# EAGLE design Interactive_SparkFun_Badge (EAGLE 6.6.0)
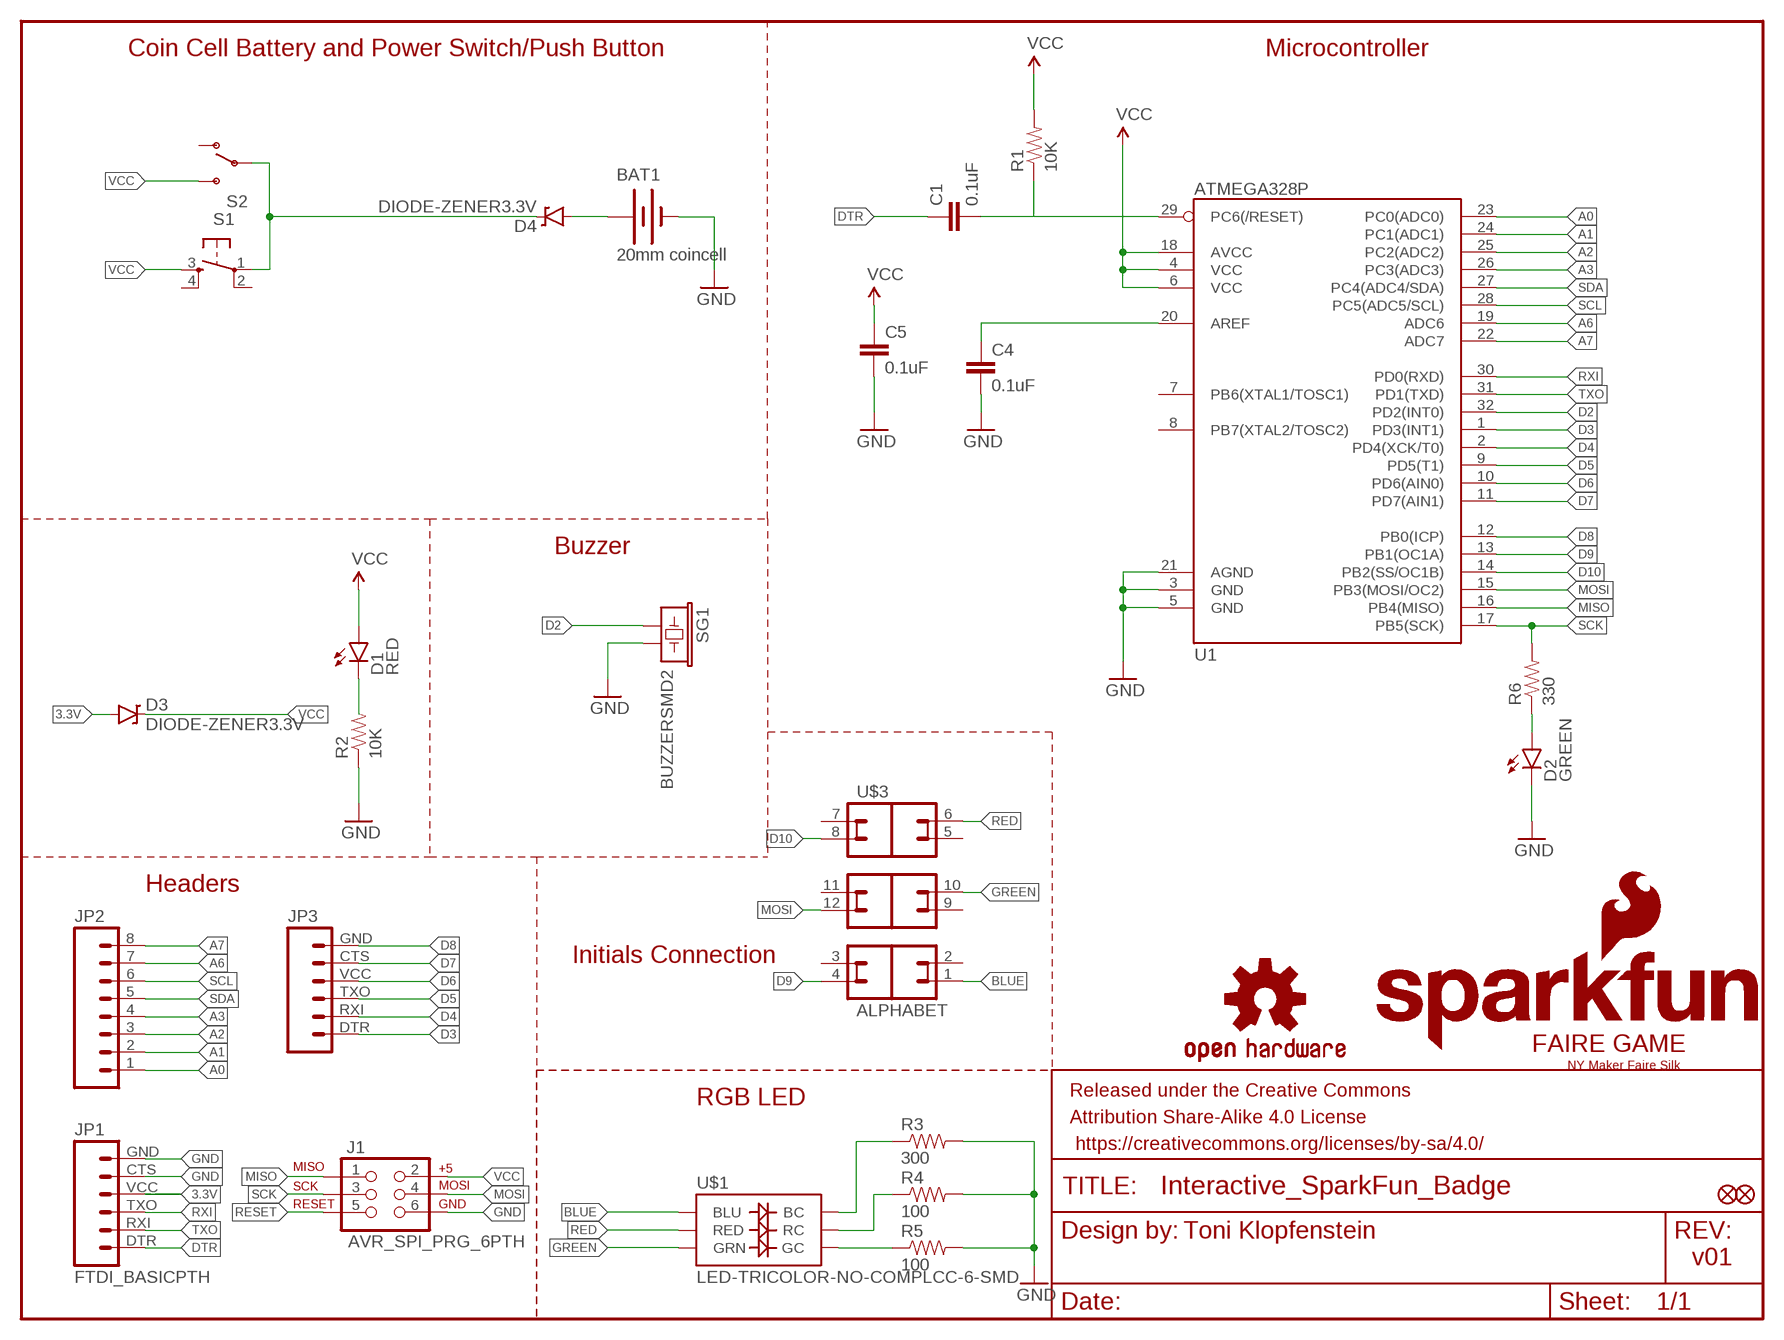
[diagram p0: schematic, sheet 1]

## Parts
BAT1  20mm coincell  BATTERY20MM_4LEGS  [BATTCON_20MM_4LEGS]
C1  0.1uF  0.1UF-25V(+80/-20%)(0603)  [0603-CAP]
C4  0.1uF  0.1UF-25V(+80/-20%)(0603)  [0603-CAP]
C5  0.1uF  0.1UF-25V(+80/-20%)(0603)  [0603-CAP]
D1  RED  LED-RED0603  [LED-0603]
D2  GREEN  LED-GREEN0603  [LED-0603]
D3  DIODE-ZENER3.3V  [SOD-323]
D4  DIODE-ZENER3.3V  [SOD-323]
FID1  FIDUCIAL1X2  [FIDUCIAL-1X2]
FID2  FIDUCIAL1X2  [FIDUCIAL-1X2]
FRAME1  FRAME-LETTER  [CREATIVE_COMMONS]
J1  AVR_SPI_PRG_6PTH  [2X3]
JP1  FTDI_BASICPTH  [FTDI_BASIC]
JP2  M081X08  [1X08]
JP3  M06SIP  [1X06]
LOGO1  OSHW-LOGOM  [OSHW-LOGO-M]
R1  10K  10KOHM1/10W1%(0603)0603  [0603-RES]
R2  10K  10KOHM1/10W1%(0603)0603  [0603-RES]
R3  300  300OHM-1/10W-1%(0603)  [0603-RES]
R4  100  100OHM1/10W1%(0603)  [0603-RES]
R5  100  100OHM1/10W1%(0603)  [0603-RES]
R6  330  330OHM1/10W1%(0603)  [0603-RES]
S1  TAC_SWITCHSMD  [TACTILE-SWITCH-SMD]
S2  SWITCH-SPDTSMD  [AYZ0202]
SG1  BUZZERSMD2  [BUZZER-CCV]
U1  ATMEGA328P  ATMEGA328_SMT  [TQFP32-08]
U$1  LED-TRICOLOR-NO-COMPLCC-6-SMD  [PLCC-6-LED]
U$2  NY_FAIRE_BACK  [NY_BACK]
U$3  ALPHABET  [INITIALS]
U$4  FAIRE_GAME_SILK  [FAIRE_GAME_SILK]

## Nets
3.3V: D3.A JP1.VCC
A0: JP2.1 U1.23(PC0(ADC0))
A1: JP2.2 U1.24(PC1(ADC1))
A2: JP2.3 U1.25(PC2(ADC2))
A3: JP2.4 U1.26(PC3(ADC3))
A6: JP2.7 U1.19(ADC6)
A7: JP2.8 U1.22(ADC7)
BLUE: U$1.AB(BLU) U$3.1
D2: SG1.+ U1.32(PD2(INT0))
D3: JP3.DTR U1.1(PD3(INT1))
D4: JP3.RXI U1.2(PD4(XCK/T0))
D5: JP3.TXO U1.9(PD5(T1))
D6: JP3.VCC U1.10(PD6(AIN0))
D7: JP3.CTS U1.11(PD7(AIN1))
D8: JP3.GND U1.12(PB0(ICP))
D9: U1.13(PB1(OC1A)) U$3.4
D10: U1.14(PB2(SS/OC1B)) U$3.8
DTR: C1.1 JP1.DTR
GND: BAT1.2(-) C4.2 C5.2 D2.C J1.6 JP1.CTS JP1.GND R2.1 R3.2 R4.2 R5.2 SG1.- U1.3(GND) U1.5(GND) U1.21(AGND)
GREEN: U$1.AG(GRN) U$3.10
MISO: J1.1 U1.16(PB4(MISO))
MOSI: J1.4 U1.15(PB3(MOSI/OC2)) U$3.12
N$1: D4.C S1.1 S2.2(P)
N$4: R3.1 U$1.CB(BC)
N$5: D1.C R2.2
N$6: R4.1 U$1.CR(RC)
N$7: R5.1 U$1.CG(GC)
N$8: C4.1 U1.20(AREF)
N$9: D2.A R6.1
N$10: BAT1.1(+) D4.A
RED: U$1.AR(RED) U$3.6
RESET: C1.2 J1.5 R1.1 U1.29(PC6(/RESET))
RXI: JP1.TXO U1.30(PD0(RXD))
SCK: J1.3 R6.2 U1.17(PB5(SCK))
SCL: JP2.6 U1.28(PC5(ADC5/SCL))
SDA: JP2.5 U1.27(PC4(ADC4/SDA))
TXO: JP1.RXI U1.31(PD1(TXD))
VCC: C5.1 D1.A D3.C J1.2 R1.2 S1.3 S2.3(S) U1.4(VCC) U1.6(VCC) U1.18(AVCC)
Unconnected: S1.2 S1.4 S2.1(O) U1.7(PB6(XTAL1/TOSC1)) U1.8(PB7(XTAL2/TOSC2)) U$3.2 U$3.3 U$3.5 U$3.7 U$3.9 U$3.11

## Notes on the sheet
- Coin Cell Battery and Power Switch/Push Button | Microcontroller
- Buzzer
- Headers
- Initials Connection
- RGB LED
- Toni Klopfenstein
- v01

## Library data of the parts
BAT1 = SparkFun-Electromechanical:BATTERY: Battery Holders Various common sizes : AA, AAA, 20mm coin cell and 12mm coin cell. 20MM_4LEGS, BATT-10373; PROD_ID: BATT-10373
C1 C4 C5 = SparkFun-Capacitors:0.1UF-25V(+80/-20%)(0603): CAP-00810 Ceramic Standard decoupling cap; PROD_ID: CAP-00810
D1 = SparkFun-LED:LED-RED: Assorted Red LEDs LilyPad 1206- DIO-09912 1206- DIO-00809 0603- DIO-00819; PROD_ID: DIO-00819
D2 = SparkFun-LED:LED-GREEN: Various green LEDs Green LEDs used in SFE Production 0603- DIO-00821 LARGE- DIO-00862 LILYPAD- DIO-09910; PROD_ID: DIO-00821
D3 D4 = SparkFun-DiscreteSemi:DIODE-ZENER: Zener Diode Production Part - 8199 3.4V Zener Voltage; PROD_ID: DIO-11284; VALUE: 3.3V
FID1 FID2 = SparkFun-Aesthetics:FIDUCIAL: Fiducial Alignment Points Various fiducial points for machine vision alignment.
FRAME1 = SparkFun-Aesthetics:FRAME-LETTER: Schematic Frame Standard 8.5x11 US Letter frame
J1 = SparkFun-Connectors:AVR_SPI_PRG_6: AVR ISP 6 Pin This is the reduced ISP connector for AVR programming. Common on Arduino. This footprint will take up less PCB space and can be used with a 10-pin to 6-pin adapter such as SKU: BOB-08508 **Special note about "TEST_POINT" package. The stop mask is on the top side, so if you want your programming test points to be on the bottom of your board, make sure to place this package on the bottom side of the board. This also ensure that the orientation to program from the bottom side will be correct.
JP1 = SparkFun-Connectors:FTDI_BASIC: FTDI Basic header with labels
JP2 = SparkFun-Connectors:M08: Header 8 Standard 8-pin 0.1" header. Use with straight break away headers (SKU : PRT-00116), right angle break away headers (PRT-00553), swiss pins (PRT-00743), machine pins (PRT-00117), and female headers (PRT-00115).
JP3 = SparkFun-Connectors:M06: Header 6 Standard 6-pin 0.1" header. Use with straight break away headers (SKU : PRT-00116), right angle break away headers (PRT-00553), swiss pins (PRT-00743), machine pins (PRT-00117), and female headers (PRT-00115). Molex polarized connector foot print use with SKU : PRT-08094 with associated crimp pins and housings. NOTES ON THE VARIANTS LOCK and LOCK_LONGPADS... This footprint was designed to help hold the alignment of a through-hole component (i.e. 6-pin header) while soldering it into place. You may notice that each hole has been shifted either up or down by 0.005 of an inch from it's more standard position (which is a perfectly straight line). This slight alteration caused the pins (the squares in the middle) to touch the edges of the holes. Because they are alternating, it causes a "brace" to hold the component in place. 0.005 has proven to be the perfect amount of "off-center" position when using our standard breakaway headers. Although looks a little odd when you look at the bare footprint, once you have a header in there, the alteration is very hard to notice. Also,if you push a header all the way into place, it is covered up entirely on the bottom side. This idea of altering the position of holes to aid alignment will be further integrated into the Sparkfun Library for other footprints. It can help hold any component with 3 or more connection pins.
LOGO1 = SparkFun-Aesthetics:OSHW-LOGO: Open Source Hardware Logo This logo indicates the piece of hardware it is found on incorporates a OSHW license and/or adheres to the definition of open source hardware found here: http://freedomdefined.org/OSHW
R1 R2 = SparkFun-Resistors:10KOHM1/10W1%(0603): RES-00824; PROD_ID: RES-00824
R3 = SparkFun-Resistors:300OHM-1/10W-1%(0603): RES-10328; PROD_ID: RES_10328
R4 R5 = SparkFun-Resistors:100OHM1/10W1%(0603): RES-07863; PROD_ID: RES-07863
R6 = SparkFun-Resistors:330OHM1/10W1%(0603): RES-00818; PROD_ID: RES-00818
S1 = SparkFun-Electromechanical:TAC_SWITCH: Momentary Switch Button commonly used for reset or general input. Spark Fun Electronics SKU : COM-00097 SMT- SWCH-08247
S2 = SparkFun-Electromechanical:SWITCH-SPDT: SPDT Switch Simple slide switch, Spark Fun Electronics SKU : COM-00102 DPDT SMT slide switch, AYZ0202, SWCH-08179; PROD_ID: SWCH-08179
SG1 = SparkFun-Electromechanical:BUZZER: Buzzer 12mm Spark Fun Electronics SKU : Comp-Buzzer
U1 = SparkFun-DigitalIC:ATMEGA328_SMT: 32-Pin Atmega328 part Commonly used on Arduino compatible boards Available in QFP and QFN packages TQFP is IC-09069 QFN is non-stock; PROD_ID: IC-09069
U$1 = SparkFun-LED:LED-TRICOLOR-NO-COM; PROD_ID: DIO-12113
U$2 = Local Library:NY_FAIRE_BACK
U$3 = ML8511:ALPHABET
U$4 = Local Library:FAIRE_GAME_SILK

## Board
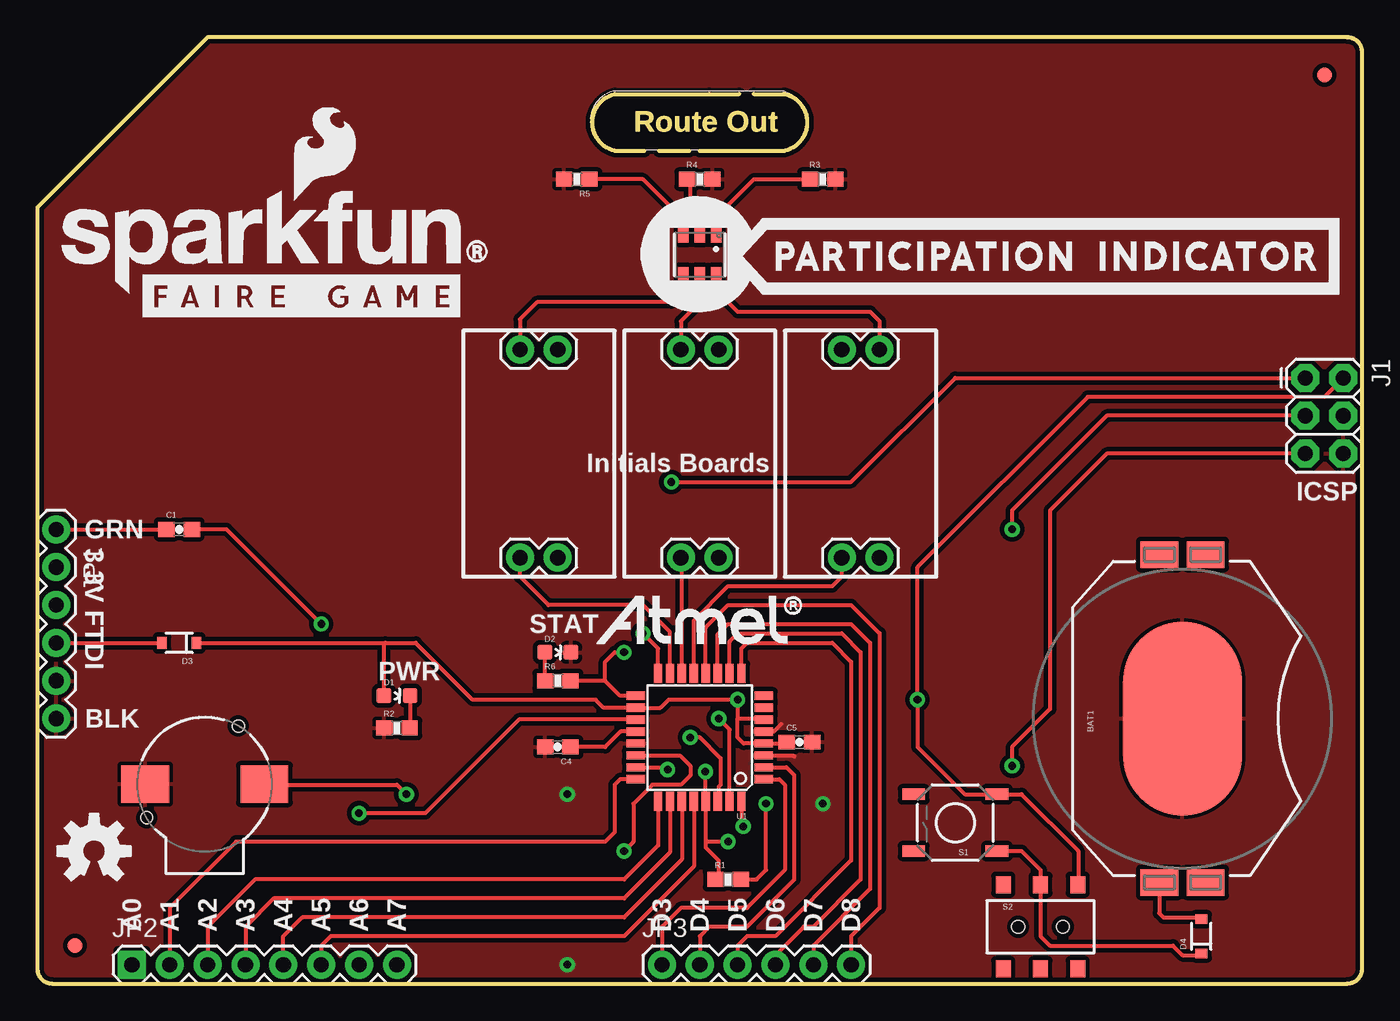
[diagram p1: board, top side]
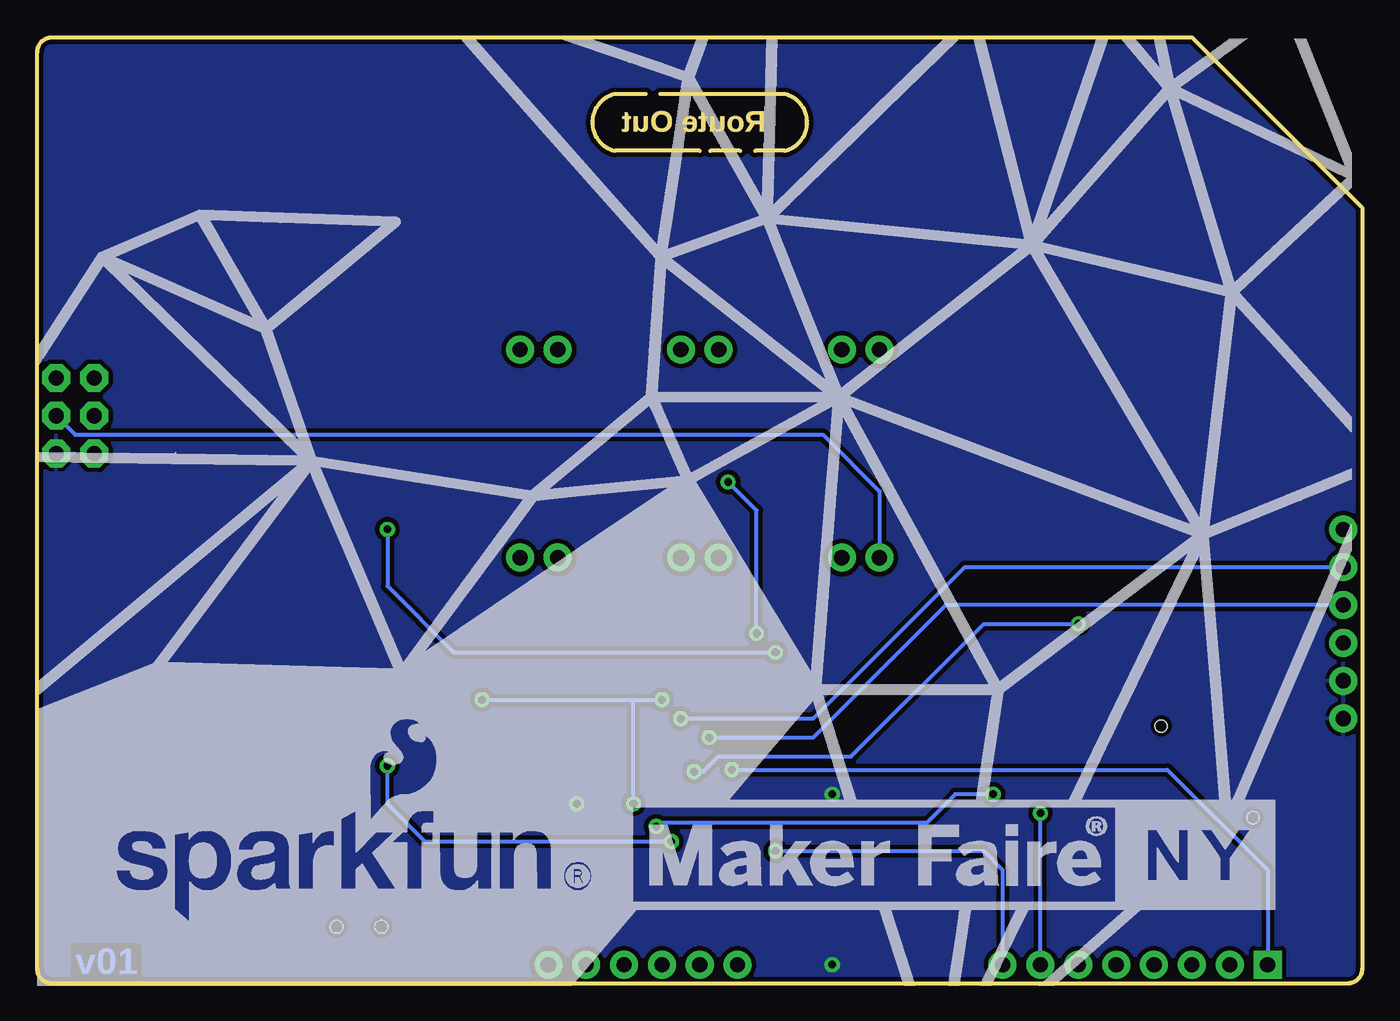
[diagram p2: board, bottom side, seen from below]

Size 88.9 x 63.5 mm. Coordinates in mm from the lower left corner, seen from the top.
Outline: 0,52.07 0,1 arc90 1,0 87.9,0 arc90 88.9,1 88.9,62.5 arc90 87.9,63.5 11.43,63.5 0,52.07
Outline: 38.73,55.88 arc-152 38.73,59.69 45.09,59.69 50.16,59.69 arc-152 50.16,55.88 44.45,55.88 38.73,55.88
Copper layers (1*16): Top 0.035mm / dielectric 1.5mm / Bottom 0.035mm
Design rules "SparkFun-2-layer": minimum track width 7mil, minimum drill 15mil, track to track 8mil, track to pad 8mil, pad to pad 8mil, via to via 8mil, smd to smd 8mil, copper to edge 8mil, drill to drill 8mil, minimum pad ring 12mil, minimum via ring 10mil, stop-mask expansion 4mil, vias tented up to drill 20mil, thermal gap 10mil

### Footprints (pad centres in the part's own frame; a part is rotated, then mirrored left to right if it is on the bottom)
BATTCON_20MM_4LEGS = smd 1.778 x 2.54: 1 -11,1.55; 3 11,1.55; P$1 -11,-1.55; P$2 11,-1.55 | smd 13 x 8: 2 0,0
0603-CAP = smd 1.1 x 1: 1 -0.85,0; 2 0.85,0
LED-0603 = smd 1 x 1: A 0,-0.877; C 0,0.877
SOD-323 = smd 0.63 x 0.83: A 1.15,0; C -1.15,0
FIDUCIAL-1X2 = smd 1 x 1: 1 0,0
2X3 = drill 1.016 pad 1.88 octagon: 1 0,0; 2 0,2.54; 3 2.54,0; 4 2.54,2.54; 5 5.08,0; 6 5.08,2.54
FTDI_BASIC = drill 1.016 pad 1.88: CTS 10.16,0; DTR 0,0; GND 12.7,0; RXI 2.54,0; TXO 5.08,0; VCC 7.62,0
1X08 = drill 1.016 pad 1.88 square: 1 0,0 | drill 1.016 pad 1.88: 2 2.54,0; 3 5.08,0; 4 7.62,0; 5 10.16,0; 6 12.7,0; 7 15.24,0; 8 17.78,0
1X06 = drill 1.016 pad 1.88: CTS 10.16,0; DTR 0,0; GND 12.7,0; RXI 2.54,0; TXO 5.08,0; VCC 7.62,0
0603-RES = smd 1.1 x 1: 1 -0.85,0; 2 0.85,0
TACTILE-SWITCH-SMD = smd 1.524 x 0.762: 1 -2.794,1.905; 2 2.794,1.905; 3 -2.794,-1.905; 4 2.794,-1.905
AYZ0202 = smd 1 x 1.15: 1 -2.5,2.825; 2 0,2.825; 3 2.5,2.825; 4 -2.5,-2.825; 5 0,-2.825; 6 2.5,-2.825 | hole 0.85: 1.5,0; -1.5,0
BUZZER-CCV = smd 3.2 x 2.5: + 4,0; - -4,0 | hole 0.8: -3.9,-2.25; 2.25,3.9
TQFP32-08 = smd 1.27 x 0.559: 1 -4.293,2.8; 2 -4.293,2; 3 -4.293,1.2; 4 -4.293,0.4; 5 -4.293,-0.4; 6 -4.293,-1.2; 7 -4.293,-2; 8 -4.293,-2.8; 17 4.293,-2.8; 18 4.293,-2; 19 4.293,-1.2; 20 4.293,-0.4; 21 4.293,0.4; 22 4.293,1.2; 23 4.293,2; 24 4.293,2.8 | smd 0.559 x 1.27: 9 -2.8,-4.293; 10 -2,-4.293; 11 -1.2,-4.293; 12 -0.4,-4.293; 13 0.4,-4.293; 14 1.2,-4.293; 15 2,-4.293; 16 2.8,-4.293; 25 2.8,4.293; 26 2,4.293; 27 1.2,4.293; 28 0.4,4.293; 29 -0.4,4.293; 30 -1.2,4.293; 31 -2,4.293; 32 -2.8,4.293
PLCC-6-LED = smd 0.7 x 1.3: AB -1.1,1.475; AG 1.1,1.475; AR 0,1.475; CB -1.1,-1.475; CG 1.1,-1.475; CR 0,-1.475
INITIALS = drill 1.016 pad 1.88: 1 3.81,1.27; 2 6.35,1.27; 3 3.81,15.24; 4 6.35,15.24; 5 14.605,1.27; 6 17.145,1.27; 7 14.605,15.24; 8 17.145,15.24; 9 25.4,1.27; 10 27.94,1.27; 11 25.4,15.24; 12 27.94,15.24

### Placement (x,y rotation side)
BAT1  76.83,17.78 90 top
C1  9.53,30.48 0 top
C4  34.92,15.88 180 top
C5  51.15,16.2 0 top
D1  24.14,19.32 270 top
D2  34.92,22.23 270 top
D3  9.53,22.86 180 top
D4  78.11,3.17 90 top
FID1  2.54,2.54 0 top
FID2  86.36,60.96 0 top
FRAME1  21.59,-8.89 0 top  (outside the outline)
J1  85.09,40.64 270 top
JP1  1.27,30.48 270 top
JP2  6.35,1.27 0 top
JP3  41.91,1.27 0 top
LOGO1  3.81,8.89 0 top
R1  46.35,6.99 0 top
R2  24.13,17.14 0 top
R3  52.7,53.98 0 top
R4  44.45,53.98 0 top
R5  36.2,53.98 180 top
R6  34.92,20.32 0 top
S1  61.59,10.79 180 top
S2  67.31,3.81 0 top
SG1  11.24,13.38 0 top
U1  44.45,16.51 180 top
U$1  44.45,48.9 180 top
U$2  1.27,0 0 top
U$3  60.33,43.81 180 top
U$4  -0.64,-0.76 0 top

### Tracks (layer width: path | path; a pad name or v marks a point on that pad's centre or on a via)
3.3V
  Top 0.254: JP1.VCC D3.A
A0  (via drill 0.51)
  Top 0.254: U1.23 42.13,14.51 v42.29,14.35
  Bottom 0.254: v42.29,14.35 13.08,14.35 6.35,7.62 JP2.1
A1
  Top 0.254: U1.24 39.11,13.71 38.73,13.34 38.73,10.16 38.1,9.53 13.34,9.53 8.89,5.08 JP2.2
A2
  Top 0.254: U1.25 41.65,9.27 39.37,6.99 14.61,6.99 11.43,3.81 JP2.3
A3
  Top 0.254: U1.26 42.45,8.79 39.37,5.71 15.88,5.71 13.97,3.81 JP2.4
A6  (via drill 0.51)
  Top 0.254: U1.19 32.31,17.71 26.04,11.43 v21.59,11.43
  Bottom 0.254: JP2.7 v21.59,11.43
A7  (via drill 0.51)
  Top 0.254: U1.22 43.11,15.31 43.81,14.61 43.81,13.97 43.18,13.34 41.27,13.34 40.01,12.06 40.01,9.53 v39.37,8.89
  Bottom 0.254: v39.37,8.89 25.4,8.89 24.13,7.62 JP2.8
BLUE
  Top 0.254: U$1.AB 45.55,46.52 46.99,45.09 55.88,45.09 56.52,44.45 U$3.1
D2  (via drill 0.51)
  Top 0.254: U1.32 47.25,10.66 v47.37,10.54 | 15.93,12.7 15.29,13.34 | 15.29,13.34 SG1.+ | 15.29,13.34 24.13,13.34 v24.77,12.7
  Bottom 0.254: v24.77,12.7 27.3,12.7 29.21,10.79 47.12,10.79 v47.37,10.54
D3
  Top 0.254: U1.1 49.79,13.71 50.16,13.34 50.16,7.62 47.62,5.08 43.18,5.08 41.91,3.81 JP3.DTR
D4
  Top 0.254: U1.2 50.26,14.51 50.8,13.97 50.8,6.99 47.62,3.81 45.09,3.81 44.45,3.17 JP3.RXI
D5
  Top 0.254: U1.9 47.25,22.48 47.62,22.86 53.34,22.86 54.61,21.59 54.61,8.26 49.53,3.17 47.62,3.17 46.99,2.54 JP3.TXO
D6
  Top 0.254: U1.10 46.45,22.95 46.99,23.5 53.98,23.5 55.24,22.23 55.24,6.99 52.07,3.81 51.44,3.81 49.53,1.91 JP3.VCC
D7
  Top 0.254: U1.11 45.65,23.43 46.35,24.13 54.61,24.13 55.88,22.86 55.88,6.35 52.07,2.54 JP3.CTS
D8
  Top 0.254: U1.12 44.85,23.89 46.35,25.4 54.61,25.4 56.52,23.5 56.52,5.08 54.61,3.17 JP3.GND
D9
  Top 0.254: U1.13 44.05,24.36 46.35,26.67 53.34,26.67 53.98,27.3 U$3.4
D10
  Top 0.254: U1.14 43.25,28.5 U$3.8
DTR
  Top 0.254: JP1.DTR C1.1
GND  (via drill 0.51)
  Top 0.254: U1.3 50.73,15.31 50.8,15.24 | U1.5 49.42,16.91 49.91,17.4
  other vias: 35.56,1.27 52.7,12.06 35.56,12.7
  pour Top (isolate 0.305): 0,62.87 0,1 arc90 1,0 87.9,0 arc90 88.9,1 88.9,62.5 arc90 87.9,63.5 -0.64,63.5
  pour Bottom (isolate 0.305): 0,63.5 0,1 arc90 1,0 87.9,0 arc90 88.9,1 88.9,62.5 arc90 87.9,63.5
GREEN
  Top 0.254: U$3.10 32.38,44.58 33.53,45.72 42.55,45.72 43.35,46.52 U$1.AG
MISO  (via drill 0.51)
  Top 0.254: U1.16 41.65,22.48 v40.64,23.5 | v42.55,33.66 54.61,33.66 61.59,40.64 J1.1
  Bottom 0.254: v40.64,23.5 40.64,31.75 v42.55,33.66
MOSI
  Top 0.254: U1.15 42.45,23.59 40.64,25.4 34.29,25.4 32.38,27.3 U$3.12
  Bottom 0.254: J1.4 86.36,36.83 36.2,36.83 32.38,33.02 U$3.12
N$1
  Top 0.254: S1.1 66.04,8.89 67.31,7.62 S2.2 67.31,3.17 67.94,2.54 76.2,2.54 76.83,1.91 77.98,1.91 D4.C
N$4
  Top 0.254: U$1.CB 45.55,51.44 48.09,53.98 R3.1
N$5
  Top 0.254: 24.77,17.36 R2.2 25.02,17.18 D1.C
N$6
  Top 0.254: U$1.CR 44.45,52.07 43.81,52.7 43.81,53.76 R4.1
N$7
  Top 0.254: U$1.CG 43.35,51.27 40.64,53.98 R5.1
N$8
  Top 0.254: U1.20 39.13,16.91 38.1,15.88 C4.1
N$9
  Top 0.254: D2.A 34.05,20.35 R6.1
N$10
  Top 0.254: BAT1.1 75.28,4.72 75.56,4.45 77.98,4.45 D4.A
RED
  Top 0.254: U$1.AR 44.45,45.72 43.18,44.45 U$3.6
RESET  (via drill 0.51)
  Top 0.254: 44.85,9.53 U1.29 44.85,14.21 v44.83,14.22 | 44.85,9.53 44.85,9.12 45.72,8.26 45.72,7.2 R1.1 | v46.35,9.53 44.85,9.53 | J1.5 71.75,35.56 67.94,31.75 67.94,18.41 65.41,15.88 v65.41,14.61 | v19.05,24.13 12.7,30.48 C1.2
  Bottom 0.254: v44.83,14.22 44.2,14.22 43.18,15.24 34.29,15.24 25.4,24.13 v19.05,24.13 | v46.35,9.53 62.87,9.53 65.41,12.06 v65.41,14.61
RXI  (via drill 0.51)
  Top 0.254: v43.81,16.51 44.45,16.51 45.85,15.11 45.85,13.34 45.72,13.21 45.72,12.29 U1.30
  Bottom 0.254: JP1.TXO 27.94,25.4 36.83,16.51 v43.81,16.51
SCK  (via drill 0.51)
  Top 0.254: U1.17 39.11,19.31 38.1,20.32 | 38.1,20.32 R6.2 | 38.1,20.32 38.1,21.59 38.73,22.23 v39.37,22.23 | J1.3 71.75,38.1 65.41,31.75 v65.41,30.48
  Bottom 0.254: v65.41,30.48 65.41,26.67 60.96,22.23 v39.37,22.23
SCL
  Top 0.254: U1.28 44.05,7.86 39.37,3.17 19.68,3.17 19.05,2.54 JP2.6
SDA
  Top 0.254: U1.27 43.25,8.32 39.37,4.45 17.78,4.45 16.51,3.17 JP2.5
TXO  (via drill 0.51)
  Top 0.254: U1.31 46.45,17.05 v45.72,17.78
  Bottom 0.254: v45.72,17.78 36.83,17.78 26.67,27.94 JP1.RXI
VCC  (via drill 0.51)
  Top 0.254: J1.2 86.36,39.37 70.48,39.37 59.05,27.94 v59.05,19.05 59.05,15.88 62.23,12.7 S1.3 66.04,12.7 69.85,8.89 69.85,6.67 S2.3 | 46.99,17.78 v46.99,19.05 42.35,19.05 41.81,18.51 U1.18 38.01,18.51 37.47,19.05 29.21,19.05 25.4,22.86 23.37,22.86 | 46.99,17.78 48.67,17.78 U1.6 | 46.99,17.78 46.99,16.51 47.39,16.11 U1.4 50.2,16.11 C5.1 | v48.9,12.06 48.9,7.62 48.26,6.99 R1.2 | D1.A 23.26,22.75 23.37,22.86 | D3.C 23.37,22.86
  Bottom 0.254: v48.9,12.06 48.9,19.05 | v59.05,19.05 48.9,19.05 | 48.9,19.05 v46.99,19.05

### Text on the board
Bottom: v01
Dimension: Route Out
tPlace: Route Out | Initials Boards | ICSP | GRN | 3.3V FTDI | STAT | PWR | BLK | A0 | A1 | A2 | A3 | A4 | A5 | A6 | A7 | D3 | D4 | D5 | D6 | D7 | D8
bPlace: Route Out
tDocu: Toni Klopfenstein